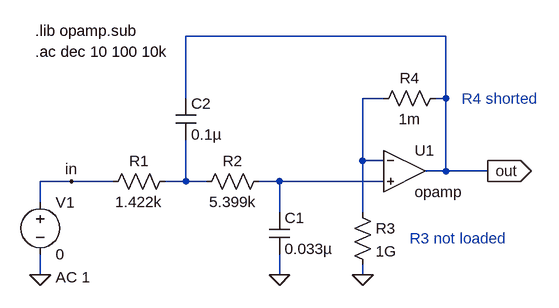
[diagram p0: schematic Butterworth_lp_1kHz.asc]
Butterworth_lp_1kHz.asc, the LTspice schematic file:
Version 4
SHEET 1 880 680
WIRE 480 -112 80 -112
WIRE 80 -16 80 -112
WIRE 384 -16 352 -16
WIRE 480 -16 480 -112
WIRE 480 -16 464 -16
WIRE 352 80 352 -16
WIRE 384 80 352 80
WIRE 480 96 480 -16
WIRE 480 96 448 96
WIRE 544 96 480 96
WIRE -96 112 -144 112
WIRE -32 112 -96 112
WIRE 80 112 80 48
WIRE 80 112 48 112
WIRE 112 112 80 112
WIRE 224 112 192 112
WIRE 384 112 224 112
WIRE -144 144 -144 112
WIRE 224 160 224 112
WIRE 352 160 352 80
WIRE -144 256 -144 224
WIRE 224 256 224 224
WIRE 352 256 352 240
FLAG -144 256 0
FLAG 224 256 0
FLAG 544 96 out
IOPIN 544 96 Out
FLAG -96 112 in
FLAG 352 256 0
SYMBOL Opamps\\opamp 416 32 R0
SYMATTR InstName U1
SYMBOL res -48 128 R270
WINDOW 0 32 56 VTop 0
WINDOW 3 0 56 VBottom 0
SYMATTR InstName R1
SYMATTR Value 1.422k
SYMBOL res 96 128 R270
WINDOW 0 32 56 VTop 0
WINDOW 3 0 56 VBottom 0
SYMATTR InstName R2
SYMATTR Value 5.399k
SYMBOL cap 208 160 R0
SYMATTR InstName C1
SYMATTR Value 0.033µ
SYMBOL cap 64 -16 R0
SYMATTR InstName C2
SYMATTR Value 0.1µ
SYMBOL voltage -144 128 R0
WINDOW 123 24 132 Left 0
WINDOW 39 0 0 Left 0
SYMATTR InstName V1
SYMATTR Value 0
SYMATTR Value2 AC 1
SYMBOL res 368 0 R270
WINDOW 0 32 56 VTop 0
WINDOW 3 0 56 VBottom 0
SYMATTR InstName R4
SYMATTR Value 1m
SYMBOL res 336 144 R0
SYMATTR InstName R3
SYMATTR Value 1G
TEXT -152 -88 Left 0 !.ac dec 10 100 10k
TEXT -152 -120 Left 0 !.lib opamp.sub
TEXT 424 200 Left 0 ;R3 not loaded
TEXT 504 -16 Left 0 ;R4 shorted

The netlist it stands for:
* Butterworth_lp_1kHz.asc
XU1 N001 N003 out opamp Aol=100K GBW=10Meg  ; pins invin noninvin out
R1 in N002 1.422k
R2 N002 N003 5.399k
C1 N003 0 0.033µ
C2 out N002 0.1µ
V1 in 0 0 AC 1
R4 N001 out 1m
R3 N001 0 1G
.ac dec 10 100 10k
.lib opamp.sub
* R3 not loaded
* R4 shorted
.backanno
.end